# Altium schematic sheet ESP32_CAN_V2-usb.SchDoc: ESP32_CAN_V2 - USB unit
size A4; DrawnBy: Balazs Finaczy, Laszlo Goczan; SheetNumber: 3; SheetTotal: 6
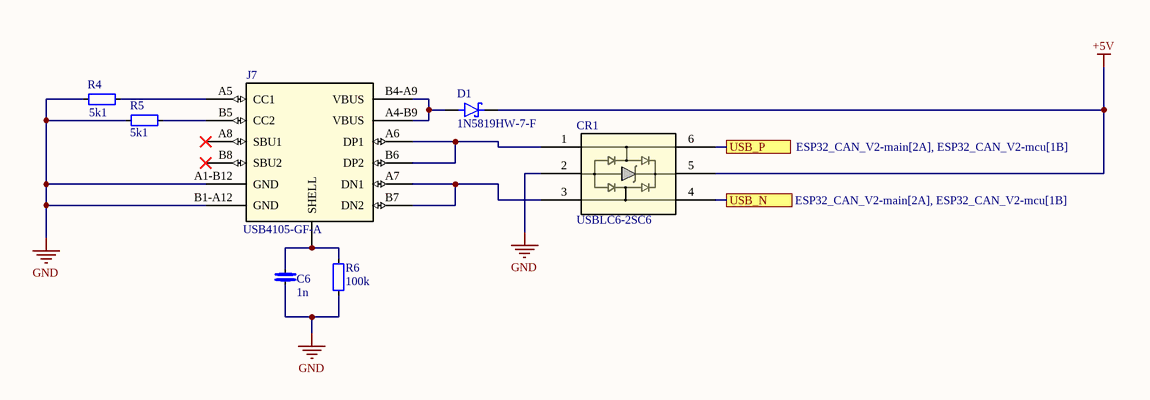
[diagram p0: ESP32_CAN_V2-usb.SchDoc]

## Parts
C6  1n  [C0603]
CR1  USBLC6-2SC6  [SOT23-6L_STM]
D1  1N5819HW-7-F  [SOD3715X145N]
J7  USB4105-GF-A  [USB4105_GCT]
R4  5k1  [R0603]
R5  5k1  [R0603]
R6  100k  [R0603]

## Ports
USB_N (see ESP32_CAN_V2-main[2A], ESP32_CAN_V2-mcu[1B]), USB_P (see ESP32_CAN_V2-main[2A], ESP32_CAN_V2-mcu[1B])

## Nets
+5V: CR1.5 D1.C(K)
GND: C6.1 CR1.2 J7.A1-B12(GND) J7.B1-A12(GND) R4.1 R5.1 R6.1
USB_N: CR1.4 ; port USB_N
USB_P: CR1.6 ; port USB_P
NetC6_2: C6.2 J7.SHELL R6.2
NetCR1_1: CR1.1 J7.A6(DP1) J7.B6(DP2)
NetCR1_3: CR1.3 J7.A7(DN1) J7.B7(DN2)
NetD1_A: D1.A J7.A4-B9(VBUS) J7.B4-A9(VBUS)
NetJ7_A5: J7.A5(CC1) R4.2
NetJ7_B5: J7.B5(CC2) R5.2

Not connected (* = marked no-connect by the designer): J7 A8(SBU1)* B8(SBU2)*

## Notes on the sheet
- Title:
- Size:
- Date:
- Author:
- A4
- Number:
- BME Solar Boat Team
- File:
- Revision:
- Sheet
- of

## Library data of the parts
C6 = C
CR1 = USBLC6-2SC6: ESD Protection for USB 2.0 High Speed; Manufacturer_Name: STMicroelectronics; Copyright: Copyright (C) 2025 Ultra Librarian. All rights reserved.; Manufacturer_Part_Number: USBLC6-2SC6; RefDes: RefDes; Type: Type
D1 = 1N5819HW-7-F: Diode Schottky 40 V 1A Surface Mount SOD-123; MF: Diodes Inc.; Value: *; SnapEDA_Link: https://www.snapeda.com/parts/1N5819HW-7-F/Diodes+Inc./view-part/?ref=snap; Purchase-URL: https://pricing.snapeda.com/search/part/1N5819HW-7-F/?ref=eda; Availability: In Stock; Price: None; Package: SOD-123 Fairchild Semiconductor; Check_prices: https://www.snapeda.com/parts/1N5819HW-7-F/Diodes+Inc./view-part/?ref=eda; MP: 1N5819HW-7-F
J7 = USB4105-GF-A: Description; Manufacturer_Name: Global Connector Technology; Copyright: Copyright (C) 2025 Ultra Librarian. All rights reserved.; Manufacturer_Part_Number: USB4105-GF-A; RefDes: RefDes; Type: Type
R4-R6 = R